# Altium schematic sheet Controller.SchDoc
size A3
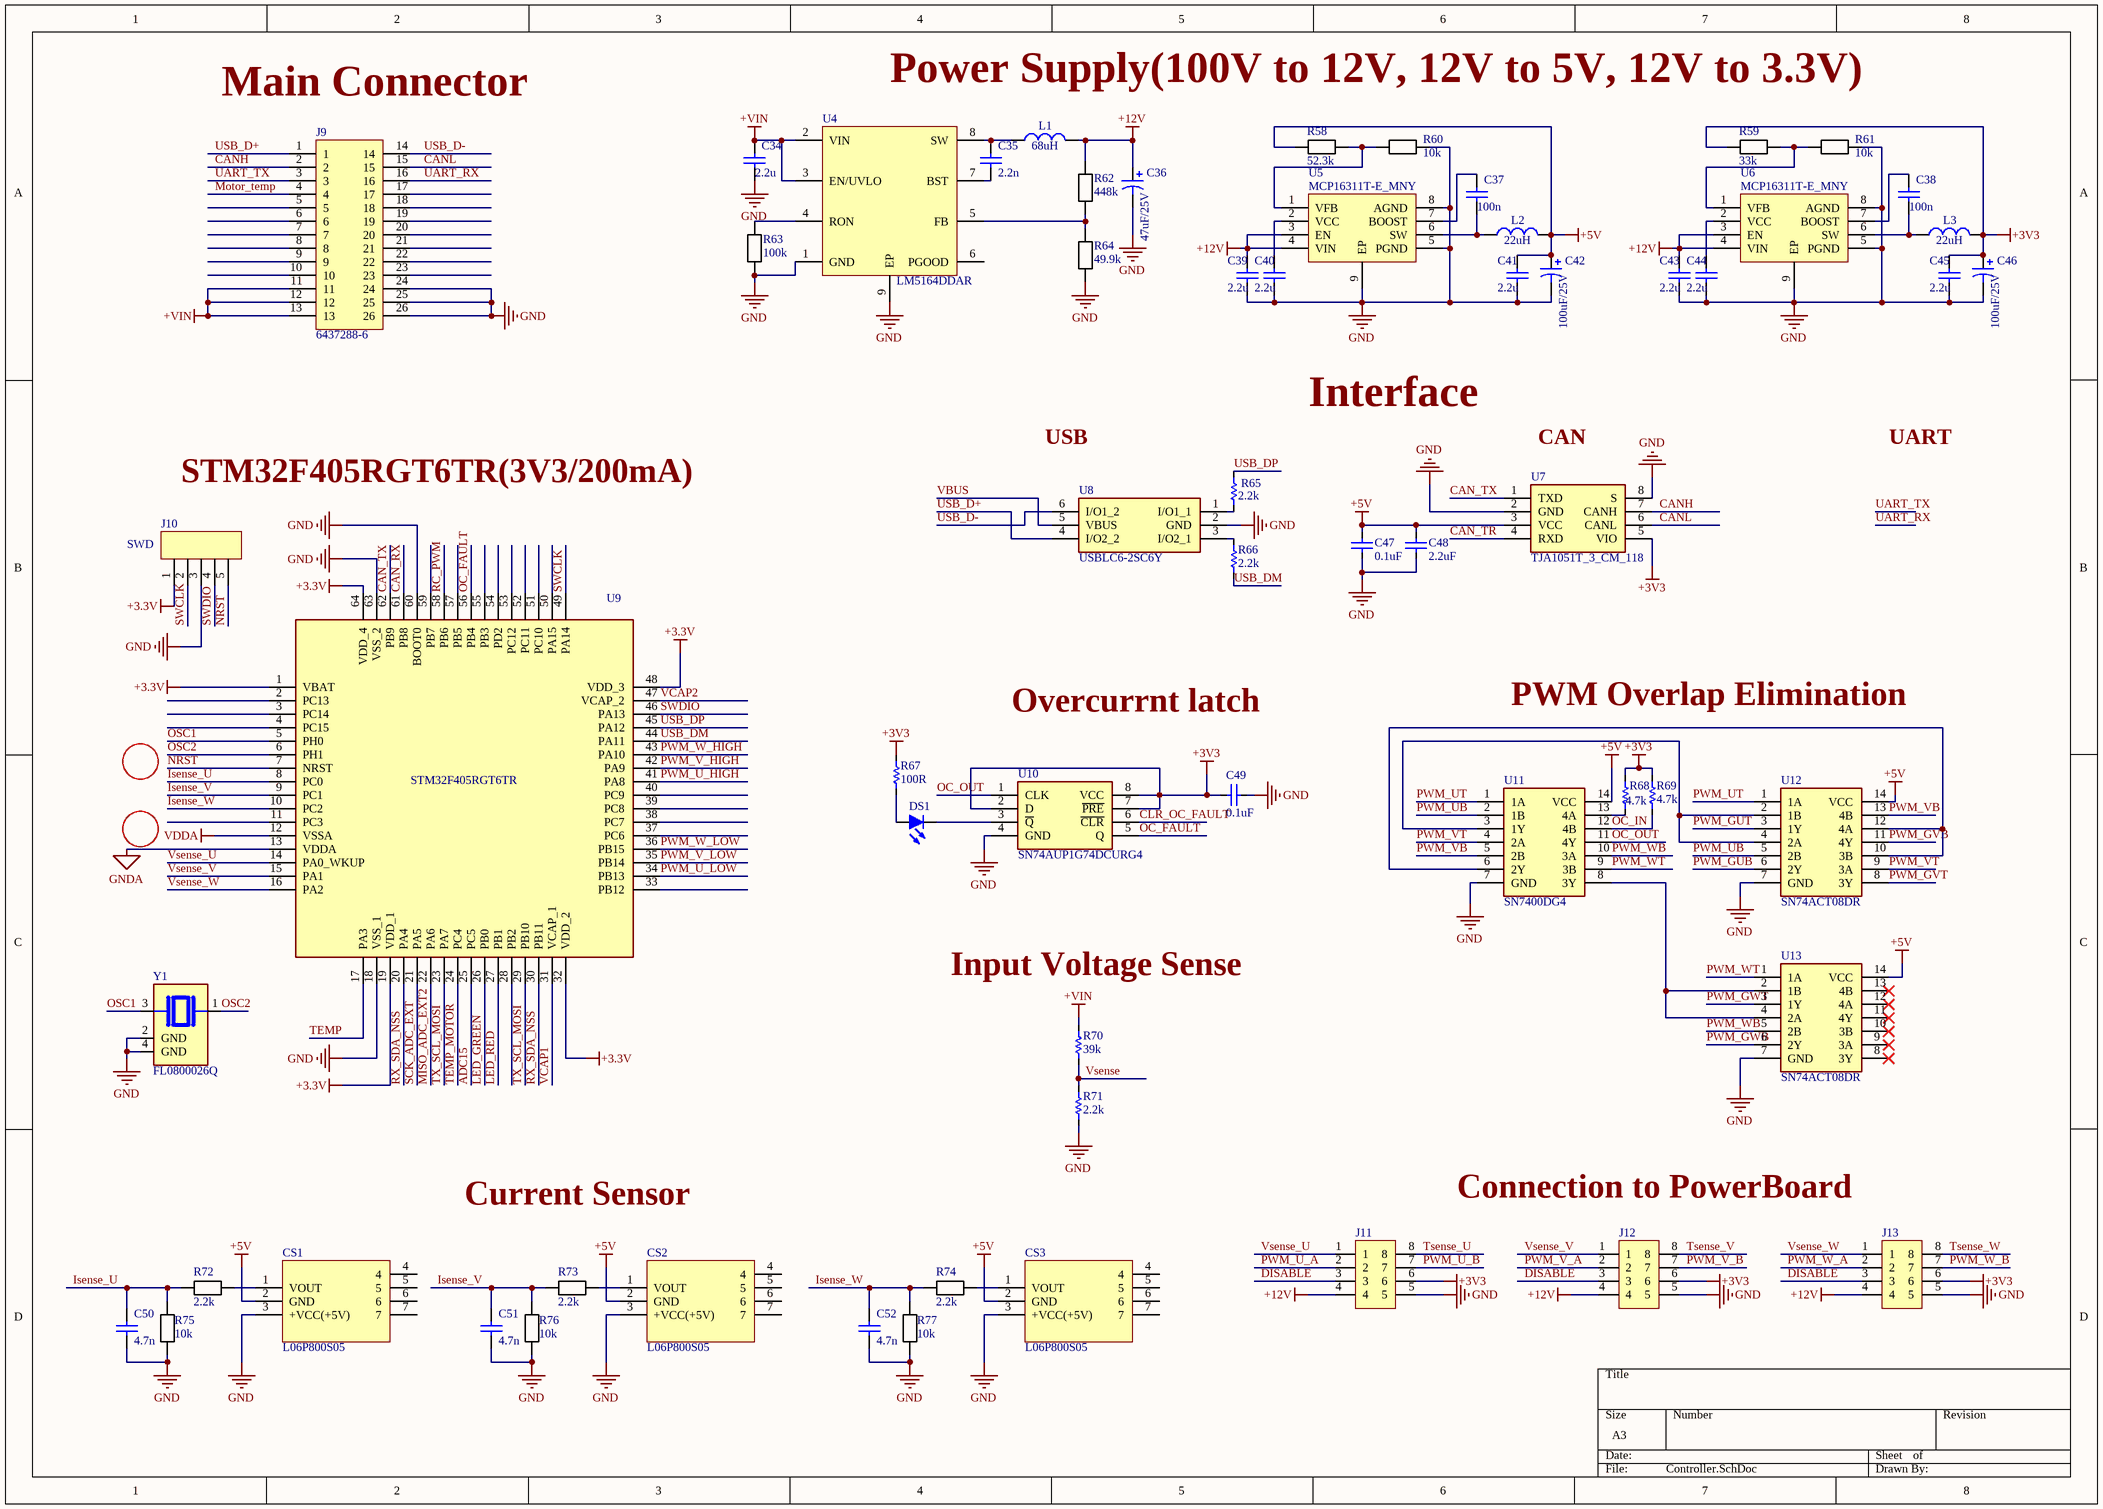
[diagram p0: Controller.SchDoc]

## Parts
C34  2.2u  [*]
C35  2.2n  [C0603]
C36  47uF/25V  [*]
C37  100n  [C0603]
C38  100n  [C0603]
C39  2.2u  [*]
C40  2.2u  [*]
C41  2.2u  [*]
C42  100uF/25V  [*]
C43  2.2u  [*]
C44  2.2u  [*]
C45  2.2u  [*]
C46  100uF/25V  [*]
C47  0.1uF  [SMD_C(0402)]
C48  2.2uF  [SMD_C(0603)]
C49  0.1uF  [SMD_C(0402)]
C50  4.7n  [C0603]
C51  4.7n  [C0603]
C52  4.7n  [C0603]
CS1  L06P800S05  [L06P800S05]
CS2  L06P800S05  [L06P800S05]
CS3  L06P800S05  [L06P800S05]
DS1  SML-D12U1WT86  [LED0603]  (value not drawn)
J9  6437288-6  [64372886]
J10  SWD  [Header-2.54m-5pin]
J11  (no value)  [*]
J12  (no value)  [*]
J13  (no value)  [*]
L1  68uH  [*]
L2  22uH  [*]
L3  22uH  [*]
R58  52.3k  [R0603]
R59  33k  [R0603]
R60  10k  [R0603]
R61  10k  [R0603]
R62  448k  [R0603]
R63  100k  [R0603]
R64  49.9k  [R0603]
R65  2.2k  [SMD_R(0402)]
R66  2.2k  [SMD_R(0402)]
R67  100R  [SMD_R(0402)]
R68  4.7k  [SMD_R(0402)]
R69  4.7k  [SMD_R(0402)]
R70  39k  [SMD_R(0402)]
R71  2.2k  [SMD_R(0402)]
R72  2.2k  [R0603]
R73  2.2k  [R0603]
R74  2.2k  [R0603]
R75  10k  [R0603]
R76  10k  [R0603]
R77  10k  [R0603]
U4  LM5164DDAR  [SOIC-8(EPAD)]
U5  MCP16311T-E_MNY  [MSOP-8]
U6  MCP16311T-E_MNY  [MSOP-8]
U7  TJA1051T_3_CM_118  [SOIC127P600X175-8N]
U8  USBLC6-2SC6Y  [SOT95P280X145-6N]
U9  STM32F405RGT6TR  [QFP50P1200X1200X160-64N]
U10  SN74AUP1G74DCURG4  [SOP50P310X90-8N]
U11  SN7400DG4  [SOIC127P600X175-14N]
U12  SN74ACT08DR  [SOIC127P600X175-14N]
U13  SN74ACT08DR  [SOIC127P600X175-14N]
Y1  FL0800026Q  [XTAL_FL0800026Q]

## Nets
+3.3V: J10.1 U9.1(VBAT) U9.19(VDD_1) U9.32(VDD_2) U9.48(VDD_3) U9.64(VDD_4)
+3V3: C45.2 C46.1 C49.2 J11.6 J12.6 J13.6 L3.2 R59.1 R67.2 R68.2 R69.2 U7.5(VIO) U10.2(D) U10.7(~{PRE}) U10.8(VCC)
+5V: C41.2 C42.1 C47.2 C48.2 CS1.2(GND) CS2.2(GND) CS3.2(GND) L2.2 R58.1 U7.3(VCC) U11.14(VCC) U12.14(VCC) U13.14(VCC)
+12V: C36.1 C39.2 C43.2 J11.4 J12.4 J13.4 L1.2 R62.2 U5.3(EN) U5.4(VIN) U6.3(EN) U6.4(VIN)
+VIN: C34.2 J9.11 J9.12 J9.13 R70.2 U4.2(VIN) U4.3(EN/UVLO)
GND: C34.1 C36.2 C39.1 C40.1 C41.1 C42.2 C43.1 C44.1 C45.1 C46.2 C47.1 C48.1 C49.1 C50.1 C51.1 C52.1 CS1.3(+VCC(+5V)) CS2.3(+VCC(+5V)) CS3.3(+VCC(+5V)) J9.24 J9.25 J9.26 J10.3 J11.5 J12.5 J13.5 R60.1 R61.1 R63.1 R64.1 R71.1 R75.1 R76.1 R77.1 U4.1(GND) U4.9(EP) U5.5(PGND) U5.8(AGND) U5.9(EP) U6.5(PGND) U6.8(AGND) U6.9(EP) U7.2(GND) U7.8(S) U8.2(GND) U9.18(VSS_1) U9.60(BOOT0) U9.63(VSS_2) U10.4(GND) U11.7(GND) U12.7(GND) U13.7(GND) Y1.2(GND) Y1.4(GND)
GNDA: U9.13(VDDA)
VDDA: U9.12(VSSA)
ADC15: U9.25(PC5)
CAN_RX: U9.61(PB8)
CAN_TR: U7.4(RXD)
CAN_TX: U7.1(TXD) U9.62(PB9)
CANH: J9.2 U7.7(CANH)
CANL: J9.15 U7.6(CANL)
CLR_OC_FAULT: U10.6(~{CLR})
DISABLE: J11.3 J12.3 J13.3
Isense_U: C50.2 R72.1 R75.2 U9.8(PC0)
Isense_V: C51.2 R73.1 R76.2 U9.9(PC1)
Isense_W: C52.2 R74.1 R77.2 U9.10(PC2)
LED_GREEN: U9.26(PB0)
LED_RED: U9.27(PB1)
MISO_ADC_EXT2: U9.22(PA6)
Motor_temp: J9.4
NRST: J10.5 U9.7(NRST)
OC_FAULT: U9.56(PB4) U10.5(Q)
OC_IN: R69.1 U11.12(4B)
OC_OUT: U10.1(CLK) U11.11(4Y)
OSC1: U9.5(PH0) Y1.3
OSC2: U9.6(PH1) Y1.1
PWM_GUB: U12.6(2Y)
PWM_GUT: U12.3(1Y)
PWM_GVB: U12.11(4Y)
PWM_GVT: U12.8(3Y)
PWM_GWB: U13.6(2Y)
PWM_GWT: U13.3(1Y)
PWM_U_A: J11.2
PWM_U_B: J11.7
PWM_U_HIGH: U9.41(PA8)
PWM_U_LOW: U9.34(PB13)
PWM_UB: U11.2(1B) U12.5(2B)
PWM_UT: U11.1(1A) U12.1(1A)
PWM_V_A: J12.2
PWM_V_B: J12.7
PWM_V_HIGH: U9.42(PA9)
PWM_V_LOW: U9.35(PB14)
PWM_VB: U11.5(2B) U12.13(4B)
PWM_VT: U11.4(2A) U12.9(3A)
PWM_W_A: J13.2
PWM_W_B: J13.7
PWM_W_HIGH: U9.43(PA10)
PWM_W_LOW: U9.36(PB15)
PWM_WB: U11.10(3A) U13.5(2B)
PWM_WT: U11.9(3B) U13.1(1A)
RC_PWM: U9.58(PB6)
RX_SDA_NSS: U9.20(PA4) U9.30(PB11)
SCK_ADC_EXT: U9.21(PA5)
SWCLK: J10.2 U9.49(PA14)
SWDIO: J10.4 U9.46(PA13)
TEMP: U9.17(PA3)
TEMP_MOTOR: U9.24(PC4)
Tsense_U: J11.8
Tsense_V: J12.8
Tsense_W: J13.8
TX_SCL_MOSI: U9.23(PA7) U9.29(PB10)
UART_RX: J9.16
UART_TX: J9.3
USB_D+: J9.1 U8.4(I/O2_2)
USB_D-: J9.14 U8.6(I/O1_2)
USB_DM: R66.2 U9.44(PA11)
USB_DP: R65.2 U9.45(PA12)
VBUS: U8.5(VBUS)
VCAP1: U9.31(VCAP_1)
VCAP2: U9.47(VCAP_2)
Vsense: R70.1 R71.2
Vsense_U: J11.1 U9.14(PA0_WKUP)
Vsense_V: J12.1 U9.15(PA1)
Vsense_W: J13.1 U9.16(PA2)
NetC35_1: C35.1 U4.7(BST)
NetC35_2: C35.2 L1.1 U4.8(SW)
NetC37_1: C37.1 L2.1 U5.6(SW)
NetC37_2: C37.2 U5.7(BOOST)
NetC38_1: C38.1 L3.1 U6.6(SW)
NetC38_2: C38.2 U6.7(BOOST)
NetC40_2: C40.2 U5.2(VCC)
NetC44_2: C44.2 U6.2(VCC)
NetCS1_1: CS1.1(VOUT) R72.2
NetCS2_1: CS2.1(VOUT) R73.2
NetCS3_1: CS3.1(VOUT) R74.2
NetDS1_A: DS1.A R67.1
NetDS1_C: DS1.C U10.3(~{Q})
NetR58_2: R58.2 R60.2 U5.1(VFB)
NetR59_2: R59.2 R61.2 U6.1(VFB)
NetR62_1: R62.1 R64.2 U4.5(FB)
NetR63_2: R63.2 U4.4(RON)
NetR65_1: R65.1 U8.1(I/O1_1)
NetR66_1: R66.1 U8.3(I/O2_1)
NetR68_1: R68.1 U11.13(4A)
NetU11_3: U11.3(1Y) U12.2(1B) U12.4(2A)
NetU11_6: U11.6(2Y) U12.10(3B) U12.12(4A)
NetU11_8: U11.8(3Y) U13.2(1B) U13.4(2A)

Not connected (* = marked no-connect by the designer): CS1 4 5 6 7; CS2 4 5 6 7; CS3 4 5 6 7; J9 5 6 7 8 9 10 17 18 19 20 21 22 23; U4 6(PGOOD); U9 2(PC13) 3(PC14) 4(PC15) 11(PC3) 28(PB2) 33(PB12) 37(PC6) 38(PC7) 39(PC8) 40(PC9) 50(PA15) 51(PC10) 52(PC11) 53(PC12) 54(PD2) 55(PB3) 57(PB5) 59(PB7); U13 8(3Y)* 9(3A)* 10(3B)* 11(4Y)* 12(4A)* 13(4B)*

## Notes on the sheet
- (near J9) Main Connector
- Power Supply(100V to 12V, 12V to 5V, 12V to 3.3V)
- USB
- Interface
- (near U7) CAN
- UART
- STM32F405RGT6TR(3V3/200mA)
- Overcurrnt latch
- PWM Overlap Elimination
- (near R70) Input Voltage Sense
- Current Sensor
- Connection to PowerBoard

## Library data of the parts
C34 = 2.2uF ± 10% 100V: Value: 2.2u
C35 = 2.2nF ± 10% 50V: Manufacturer: Yageo; Price: 0.1; Supplier: Mouser; Value: 2.2n
C36 = Cap Pol1: 47uF ±20% 25V; Value: 47uF/25V
C37 C38 = 100nF ± 10% 50V: Manufacturer: Yageo; Manufacturer Part Number: CC0603KRX7R9BB104; Supplier Part Number: 603-CC603KRX7R9BB104; Price: 0.1; Supplier: Mouser; Value: 100n
C39-C41 C43-C45 = 2.2uF ± 10% 25V: Value: 2.2u
C42 C46 = Cap Pol1: 100uF ±20% 25V; Value: 100uF/25V
C47 C49 = Cap_1: Multilayer Ceramic Capacitors MLCC - SMD/SMT 50 V 0.1uF X7R 0603 10%; Manufacturer: Yageo; Manufacturer Part Number: CC0603KPX7R9BB104; Supplier 1: Digi-Key; Supplier Part Number 1: 311-3567-1-ND
C48 = Cap_4: Multilayer Ceramic Capacitors MLCC - SMD/SMT 2.2 uF 50 VDC 10% 1206 X7R AEC-Q200; Manufacturer: Yageo; Manufacturer Part Number: GCM31CR71H225KA55K; Supplier 1: Digi-Key; Supplier Part Number 1: 311-3567-1-ND
C50-C52 = 4.7nF ± 10% 50V: Manufacturer: Yageo; Price: 0.1; Supplier: Mouser; Value: 4.7n
CS1-CS3 = L06P800S05: Board Mount Current Sensors Current Sensor, +/-800A, +5VDC, PCB, Open Loop, Aperture, 2.5V+/-1.5V Output; Manufacturer: Tamura; Supplier Part Number: 838-L06P800S05; Price: 20; Manufacturer Part Number: L06P800S05; Value: L06P800S05; Supplier: Mouser
DS1 = SML-D12U1WT86: Typical RED GaAs LED; Manufacturer: Rohm Semiconductor; Supplier: Mouser; Supplier Part Number: 755-SML-D12U1WT86; Manufacturer Part Number: SML-D12U1WT86; Value: SML-D12U1WT86; Price: 0.2
J9 = 6437288-6: Header vert 26 way 4 row Tab Superseal; Manufacturer: TE Connectivity; Supplier Part Number: 571-6437288-6; Manufacturer Part Number: 6437288-6; Supplier: Mouser; Value: 6437288-6
J10 = 5PinConnector
J11-J13 = PCB Header: 2 Row 2.54mm Pitch 8 pins
L1-L3 = Inductor
  L1: Value: 68uH
  L2 L3: Value: 22uH
R58 = 52.3 kohm 0.1W ±1%: Manufacturer Part Number: RC0603FR-0752K3L; Manufacturer: Yageo; Value: 52.3k; Supplier: Mouser; Supplier Part Number: 603-RC0603FR-0752K3L; Price: 0.1
R59 = 33 kohm 0.1W ±1%: Manufacturer Part Number: RC0603FR-0733KL; Manufacturer: Yageo; Value: 33k; Supplier: Mouser; Supplier Part Number: 603-RC0603FR-0733KL; Price: 0.1
R60 R61 R75-R77 = 10 kohm 0.1W ±1%: Manufacturer Part Number: RC0603FR-0710KL; Manufacturer: Yageo; Value: 10k; Supplier: Mouser; Supplier Part Number: 603-RC0603FR-0710KL; Price: 0.1
R62 = 448 kohm 0.1W ±1%: Manufacturer Part Number: RC0603FR-07448KL; Manufacturer: Yageo; Value: 448k; Supplier: Mouser; Supplier Part Number: 603-RC0603FR-07448KL; Price: 0.1
R63 = 100 kohm 0.1W ±1%: Manufacturer Part Number: RC0603FR-07100KL; Manufacturer: Yageo; Value: 100k; Supplier: Mouser; Supplier Part Number: 603-RC0603FR-07100KL; Price: 0.1
R64 = 49.9 kohm 0.1W ±1%: Manufacturer Part Number: RC0603FR-0749K9L; Manufacturer: Yageo; Value: 49.9k; Supplier: Mouser; Supplier Part Number: 603-RC0603FR-0749K9L; Price: 0.1
R65 R66 = Res Semi_2: CRCW04024R02FKED; Published: 8-Jun-2000; LatestRevisionDate: 17-Jul-2002; LatestRevisionNote: Re-released for DXP Platform.; PackageReference: AXIAL-0.5; Publisher: Altium Limited; PackageDescription: Axial Device, Thru-Hole; 2 Leads; 0.5 in Pin Spacing
R67 = Res Semi_1: CRCW04024R02FKED; Published: 8-Jun-2000; LatestRevisionDate: 17-Jul-2002; LatestRevisionNote: Re-released for DXP Platform.; PackageReference: AXIAL-0.5; Publisher: Altium Limited; PackageDescription: Axial Device, Thru-Hole; 2 Leads; 0.5 in Pin Spacing
R68 R69 = Res Semi_3: CRCW04024R02FKED; Published: 8-Jun-2000; LatestRevisionDate: 17-Jul-2002; LatestRevisionNote: Re-released for DXP Platform.; PackageReference: AXIAL-0.5; Publisher: Altium Limited; PackageDescription: Axial Device, Thru-Hole; 2 Leads; 0.5 in Pin Spacing
R70 R71 = Res Semi_5: CRCW04024R02FKED; Published: 8-Jun-2000; LatestRevisionDate: 17-Jul-2002; LatestRevisionNote: Re-released for DXP Platform.; PackageReference: AXIAL-0.5; Publisher: Altium Limited; PackageDescription: Axial Device, Thru-Hole; 2 Leads; 0.5 in Pin Spacing
R72-R74 = 2.2 kohm 0.1W ±1%: Manufacturer Part Number: RC0603FR-072K2L; Manufacturer: Yageo; Value: 2.2k; Supplier: Mouser; Supplier Part Number: 603-RC0603FR-072K2L; Price: 0.1
U4 = LM5164DDAR: Texas Instruments 6-V to 100-V Input, 1-A Synchronous Buck DC-DC Converter With Ultra-Low IQ 8-SO PowerPAD -40 to 150; Value: 1.7mm; Supplier Part Number: 595-LM5164DDAR; Price: 3.5; Manufacturer: Texas Instruments; Manufacturer Part Number: LM5164DDAR; Supplier: Mouser
U5 U6 = MCP16311T-E_MNY: Microchip, MCP16311T-E/MNY Step Down DC-DC Converter 1A Adjustable, 2  24 V 8-Pin, TDFN; Supplier Part Number: 579-MCP16311T-E/MNY; Price: 1.8; Manufacturer: Microchip; Manufacturer Part Number: MCP16311T-E/MNY; Value: MCP16311T-E/MNY; Supplier: Mouser
U7 = TJA1051T_3_CM_118: CAN Interface IC BL Advanced Automotive Analog; Manufacturer_Name: NXP; Manufacturer_Part_Number: TJA1051T/3/CM,118; Geometry.Height: 1.75mm; Mouser Part Number: 771-TJA1051T/3CM118; Mouser Price/Stock: https://www.mouser.co.uk/ProductDetail/NXP-Semiconductors/TJA1051T-3-CM118?qs=5XOdhvmYM0NUkmo%252BpXvJfw%3D%3D; Datasheet Link: http://www.nxp.com/docs/en/data-sheet/TJA1051.pdf
U8 = USBLC6-2SC6Y: Low Cap. ESD Protection Auto SOT-23-6 STMicroelectronics USBLC6-2SC6Y, Dual Uni-Directional TVS Diode Array, 6-Pin SOT-23; Geometry.Height: 1.45mm; Mouser Part Number: 511-USBLC6-2SC6Y; Mouser Price/Stock: https://www.mouser.co.uk/ProductDetail/STMicroelectronics/USBLC6-2SC6Y?qs=gNDSiZmRJS%2FOgDexvXkdow%3D%3D; Manufacturer_Name: STMicroelectronics; Manufacturer_Part_Number: USBLC6-2SC6Y; Datasheet Link: https://componentsearchengine.com/Datasheets/1/USBLC6-2SC6Y.pdf
U9 = STM32F405RGT6TR: STM32F405RGT6TR, 32 bit ARM Cortex M4 MCU 168MHz 1024 kB Flash, 192 kB RAM, 2xUSB CAN I2C 64-Pin LQFP; Manufacturer_Name: STMicroelectronics; Geometry.Height: 1.6mm; Mouser Part Number: 511-STM32F405RGT6TR; Mouser Price/Stock: https://www.mouser.co.uk/ProductDetail/STMicroelectronics/STM32F405RGT6TR?qs=MavH1QghrkHshpR6GkvPIg%3D%3D; Manufacturer_Part_Number: STM32F405RGT6TR; Datasheet Link: http://www.st.com/web/en/resource/technical/document/datasheet/DM00037051.pdf
U10 = SN74AUP1G74DCURG4: Flip Flops Lo PWR SNGL Pos Edge Trgrd DType FlipFlop; Manufacturer_Name: Texas Instruments; Geometry.Height: 0.9mm; Mouser Part Number: 595-74AUP1G74DCURG4; Mouser Price/Stock: https://www.mouser.co.uk/ProductDetail/Texas-Instruments/SN74AUP1G74DCURG4?qs=7kv20MEVUlhYDCdFtbMd%2FA%3D%3D; Manufacturer_Part_Number: SN74AUP1G74DCURG4; Datasheet Link: *
U11 = SN7400DG4: NAND Gate 4-Element 2-IN Bipolar 14-Pin SOIC Tube; Manufacturer_Name: Texas Instruments; Geometry.Height: 1.75mm; Mouser Part Number: 595-SN7400DG4; Mouser Price/Stock: https://www.mouser.co.uk/ProductDetail/Texas-Instruments/SN7400DG4?qs=E8lYj0tdJGGtKkNRXTqCCA%3D%3D; Manufacturer_Part_Number: SN7400DG4; Datasheet Link: https://www.arrow.com/en/products/sn7400dg4/texas-instruments
U12 U13 = SN74ACT08DR: Texas Instruments SN74ACT08DR, AND Quad 2 Input AND, 4.5  5.5 V, 14-Pin SOIC; Geometry.Height: 1.75mm; Mouser Part Number: 595-SN74ACT08DR; Mouser Price/Stock: https://www.mouser.co.uk/ProductDetail/Texas-Instruments/SN74ACT08DR?qs=AMJt07B76uu%2FkRdXJtIwhw%3D%3D; Manufacturer_Name: Texas Instruments; Manufacturer_Part_Number: SN74ACT08DR; Datasheet Link: http://www.ti.com/lit/gpn/sn74act08
Y1 = FL0800026Q: 8 MHz Â±30ppm Crystal 8pF 400 Ohms 4-SMD, No Lead; MF: Diodes Incorporated; Package: NON STANDARD-4 Diodes Inc.; Price: None; Check_prices: https://www.snapeda.com/parts/FL0800026Q/Diodes+Inc./view-part/?ref=eda; Value: *; SnapEDA_Link: https://www.snapeda.com/parts/FL0800026Q/Diodes+Inc./view-part/?ref=snap; MP: FL0800026Q; Availability: In Stock; Purchase-URL: https://pricing.snapeda.com/search?q=FL0800026Q&ref=eda